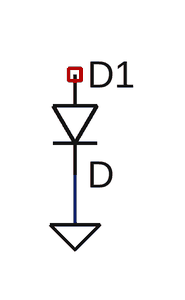
[diagram p0: schematic Test.asc]
Test.asc, the LTspice schematic file:
Version 4
SHEET 1 880 680
WIRE 80 80 80 48
FLAG 80 80 0
SYMBOL diode 64 -16 R0
SYMATTR InstName D1

The netlist it stands for:
* Test.asc
D1 NC_01 0 D
.model D D
.lib standard.dio
.backanno
.end